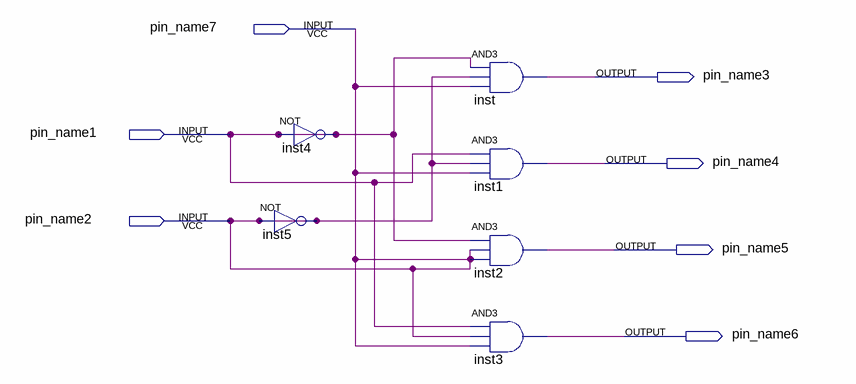
[diagram p0: schematic sheet]
// Quartus schematic DecoderDemo.bdf as structural Verilog: 6 symbols, 7 pins
module DecoderDemo (
  input  pin_name7,
  input  pin_name1,
  input  pin_name2,
  output pin_name3,
  output pin_name4,
  output pin_name5,
  output pin_name6
);

  not inst4 (pin_name1, pin_name1);
  not inst5 (pin_name2, pin_name2);
  and inst (pin_name3, pin_name1, pin_name2, pin_name2);
  and inst1 (pin_name4, pin_name1, pin_name2, pin_name2);
  and inst2 (pin_name5, pin_name1, pin_name2, pin_name2);
  and inst3 (pin_name6, pin_name1, pin_name2, pin_name2);

  assign pin_name7 = pin_name2;
endmodule
